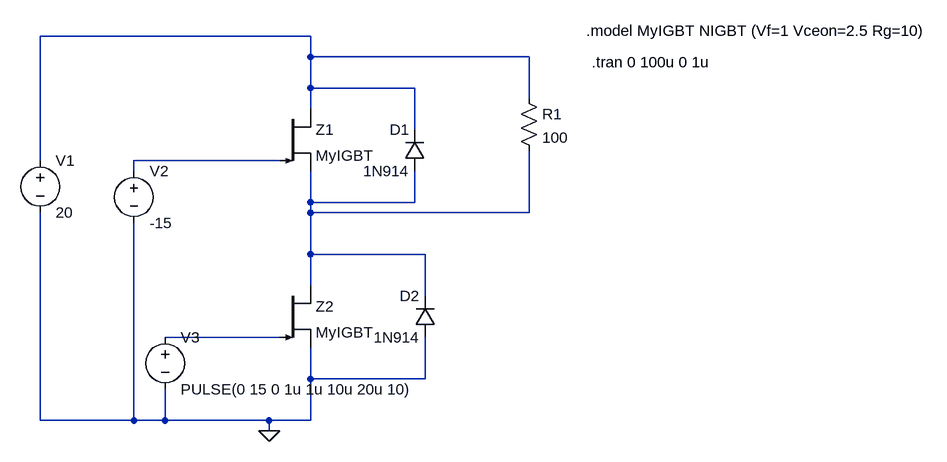
[diagram p0: schematic HalfBridge.asc]
HalfBridge.asc, the LTspice schematic file:
Version 4
SHEET 1 1292 688
WIRE 352 64 -64 64
WIRE 352 96 352 64
WIRE 688 96 352 96
WIRE 352 144 352 96
WIRE 512 144 352 144
WIRE 688 160 688 96
WIRE 352 176 352 144
WIRE 512 208 512 144
WIRE -64 256 -64 64
WIRE 304 256 80 256
WIRE 80 272 80 256
WIRE 352 320 352 272
WIRE 512 320 512 272
WIRE 512 320 352 320
WIRE 352 336 352 320
WIRE 688 336 688 240
WIRE 688 336 352 336
WIRE 352 400 352 336
WIRE 528 400 352 400
WIRE 352 448 352 400
WIRE 528 464 528 400
WIRE 304 528 128 528
WIRE 352 592 352 544
WIRE 528 592 528 528
WIRE 528 592 352 592
WIRE -64 656 -64 336
WIRE 80 656 80 352
WIRE 80 656 -64 656
WIRE 128 656 128 608
WIRE 128 656 80 656
WIRE 288 656 128 656
WIRE 352 656 352 592
WIRE 352 656 288 656
WIRE 288 672 288 656
FLAG 288 672 0
SYMBOL Misc/NIGBT 304 176 R0
SYMATTR InstName Z1
SYMATTR Value MyIGBT
SYMBOL diode 528 272 R180
WINDOW 0 24 64 Left 2
WINDOW 3 24 0 Left 2
SYMATTR InstName D1
SYMATTR Value 1N914
SYMBOL diode 544 528 R180
WINDOW 0 24 64 Left 2
WINDOW 3 24 0 Left 2
SYMATTR InstName D2
SYMATTR Value 1N914
SYMBOL Voltage -64 240 R0
SYMATTR InstName V1
SYMATTR Value 20
SYMBOL Voltage 80 256 R0
SYMATTR InstName V2
SYMATTR Value -15
SYMBOL Voltage 128 512 R0
SYMATTR InstName V3
SYMATTR Value PULSE(0 15 0 1u 1u 10u 20u 10)
SYMBOL Res 672 144 R0
SYMATTR InstName R1
SYMATTR Value 100
SYMBOL Misc/NIGBT 304 448 R0
SYMATTR InstName Z2
SYMATTR Value MyIGBT
TEXT 776 56 Left 2 !.model MyIGBT NIGBT (Vf=1 Vceon=2.5 Rg=10)
TEXT 784 104 Left 2 !.tran 0 100u 0 1u

The netlist it stands for:
* HalfBridge.asc
Z1 N001 N002 N003 MyIGBT
D1 N003 N001 1N914
D2 0 N003 1N914
V1 N001 0 20
V2 N002 0 -15
V3 N004 0 PULSE(0 15 0 1u 1u 10u 20u 10)
R1 N001 N003 100
Z2 N003 N004 0 MyIGBT
.model D D
.lib standard.dio
.model MyIGBT NIGBT (Vf=1 Vceon=2.5 Rg=10)
.tran 0 100u 0 1u
.backanno
.end